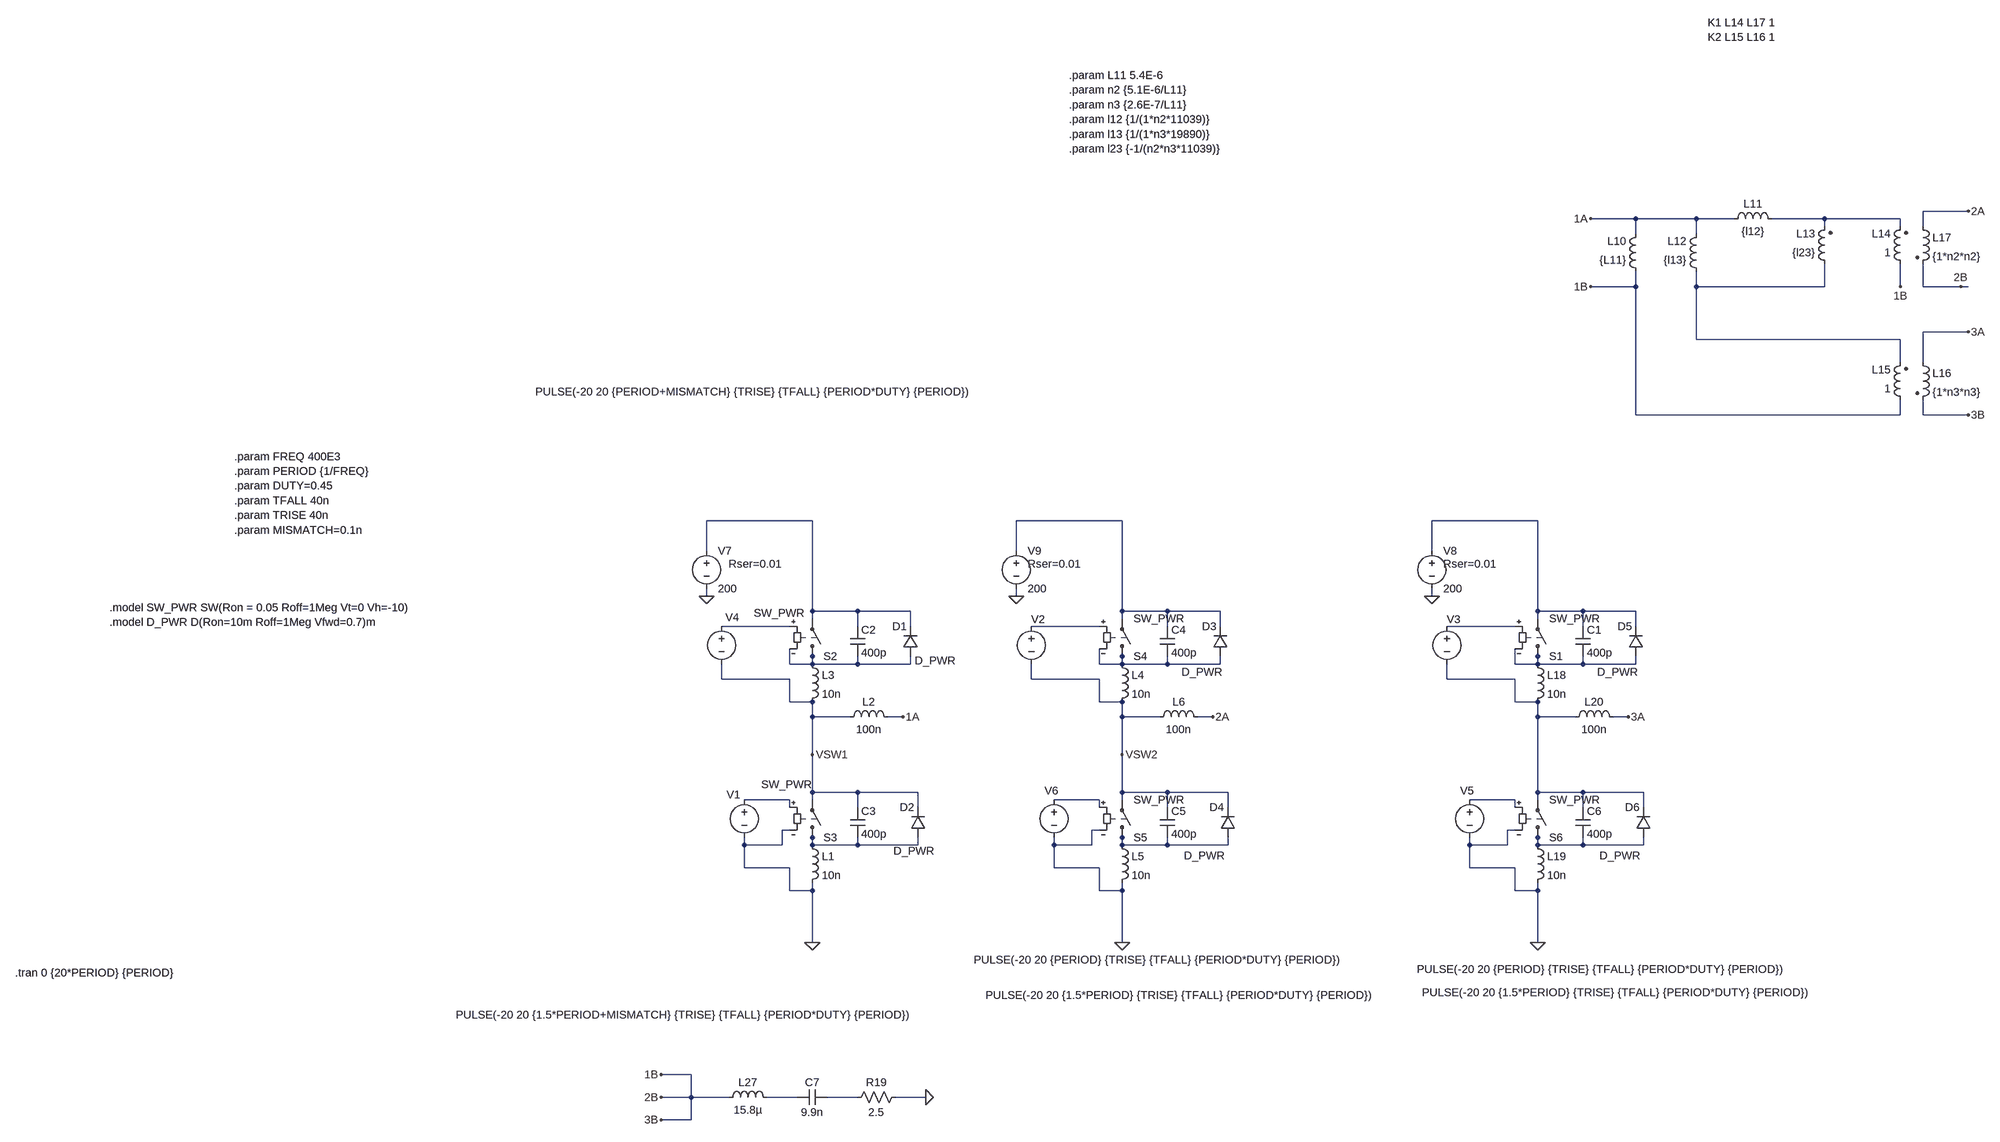
[diagram p0: schematic inverter_mismatch.asc]
inverter_mismatch.asc, the LTspice schematic file:
Version 4
SHEET 1 3140 2060
WIRE 2576 -784 2480 -784
WIRE 1872 -768 1776 -768
WIRE 2000 -768 1872 -768
WIRE 2080 -768 2000 -768
WIRE 2272 -768 2160 -768
WIRE 2432 -768 2272 -768
WIRE 2272 -752 2272 -768
WIRE 2432 -752 2432 -768
WIRE 2480 -752 2480 -784
WIRE 1872 -736 1872 -768
WIRE 2000 -736 2000 -768
WIRE 1872 -624 1872 -656
WIRE 1872 -624 1776 -624
WIRE 2000 -624 2000 -656
WIRE 2272 -624 2272 -672
WIRE 2272 -624 2000 -624
WIRE 2432 -624 2432 -672
WIRE 2480 -624 2480 -672
WIRE 2560 -624 2480 -624
WIRE 2576 -624 2560 -624
WIRE 2576 -528 2480 -528
WIRE 2000 -512 2000 -624
WIRE 2432 -512 2000 -512
WIRE 2432 -464 2432 -512
WIRE 2480 -464 2480 -528
WIRE 1872 -352 1872 -624
WIRE 2432 -352 2432 -384
WIRE 2432 -352 1872 -352
WIRE 2480 -352 2480 -384
WIRE 2576 -352 2480 -352
WIRE 128 -128 -96 -128
WIRE 784 -128 560 -128
WIRE 1664 -128 1440 -128
WIRE -96 -64 -96 -128
WIRE 560 -64 560 -128
WIRE 1440 -64 1440 -128
WIRE -96 32 -96 16
WIRE 560 32 560 16
WIRE 1440 32 1440 16
WIRE 128 64 128 -128
WIRE 224 64 128 64
WIRE 336 64 224 64
WIRE 784 64 784 -128
WIRE 880 64 784 64
WIRE 992 64 880 64
WIRE 1664 64 1664 -128
WIRE 1760 64 1664 64
WIRE 1872 64 1760 64
WIRE 128 80 128 64
WIRE 784 80 784 64
WIRE 1664 80 1664 64
WIRE 80 96 -64 96
WIRE 224 96 224 64
WIRE 336 96 336 64
WIRE 736 96 592 96
WIRE 880 96 880 64
WIRE 992 96 992 64
WIRE 1616 96 1472 96
WIRE 1760 96 1760 64
WIRE 1872 96 1872 64
WIRE 128 160 128 144
WIRE 784 160 784 144
WIRE 1664 160 1664 144
WIRE 80 176 80 144
WIRE 128 176 128 160
WIRE 128 176 80 176
WIRE 224 176 224 160
WIRE 224 176 128 176
WIRE 336 176 336 160
WIRE 336 176 224 176
WIRE 736 176 736 144
WIRE 784 176 784 160
WIRE 784 176 736 176
WIRE 880 176 880 160
WIRE 880 176 784 176
WIRE 992 176 992 160
WIRE 992 176 880 176
WIRE 1616 176 1616 144
WIRE 1664 176 1664 160
WIRE 1664 176 1616 176
WIRE 1760 176 1760 160
WIRE 1760 176 1664 176
WIRE 1872 176 1872 160
WIRE 1872 176 1760 176
WIRE -64 208 -64 176
WIRE 80 208 -64 208
WIRE 592 208 592 176
WIRE 736 208 592 208
WIRE 1472 208 1472 176
WIRE 1616 208 1472 208
WIRE 80 256 80 208
WIRE 128 256 80 256
WIRE 736 256 736 208
WIRE 784 256 736 256
WIRE 1616 256 1616 208
WIRE 1664 256 1616 256
WIRE 128 288 128 256
WIRE 208 288 128 288
WIRE 320 288 288 288
WIRE 784 288 784 256
WIRE 864 288 784 288
WIRE 976 288 944 288
WIRE 1664 288 1664 256
WIRE 1744 288 1664 288
WIRE 1856 288 1824 288
WIRE 128 368 128 288
WIRE 784 368 784 288
WIRE 128 448 128 368
WIRE 224 448 128 448
WIRE 352 448 224 448
WIRE 784 448 784 368
WIRE 880 448 784 448
WIRE 1008 448 880 448
WIRE 1664 448 1664 288
WIRE 1760 448 1664 448
WIRE 1888 448 1760 448
WIRE 80 464 -16 464
WIRE 128 464 128 448
WIRE 736 464 640 464
WIRE 784 464 784 448
WIRE 1616 464 1520 464
WIRE 1664 464 1664 448
WIRE 80 480 80 464
WIRE 224 480 224 448
WIRE 352 480 352 448
WIRE 736 480 736 464
WIRE 880 480 880 448
WIRE 1008 480 1008 448
WIRE 1616 480 1616 464
WIRE 1760 480 1760 448
WIRE 1888 480 1888 448
WIRE 80 528 64 528
WIRE 736 528 720 528
WIRE 1616 528 1600 528
WIRE 128 544 128 528
WIRE 784 544 784 528
WIRE 1664 544 1664 528
WIRE -16 560 -16 544
WIRE 64 560 64 528
WIRE 64 560 -16 560
WIRE 128 560 128 544
WIRE 224 560 224 544
WIRE 224 560 128 560
WIRE 352 560 352 544
WIRE 352 560 224 560
WIRE 640 560 640 544
WIRE 720 560 720 528
WIRE 720 560 640 560
WIRE 784 560 784 544
WIRE 880 560 880 544
WIRE 880 560 784 560
WIRE 1008 560 1008 544
WIRE 1008 560 880 560
WIRE 1520 560 1520 544
WIRE 1600 560 1600 528
WIRE 1600 560 1520 560
WIRE 1664 560 1664 544
WIRE 1760 560 1760 544
WIRE 1760 560 1664 560
WIRE 1888 560 1888 544
WIRE 1888 560 1760 560
WIRE -16 608 -16 560
WIRE 80 608 -16 608
WIRE 640 608 640 560
WIRE 736 608 640 608
WIRE 1520 608 1520 560
WIRE 1616 608 1520 608
WIRE 80 656 80 608
WIRE 128 656 128 640
WIRE 128 656 80 656
WIRE 736 656 736 608
WIRE 784 656 784 640
WIRE 784 656 736 656
WIRE 1616 656 1616 608
WIRE 1664 656 1664 640
WIRE 1664 656 1616 656
WIRE 128 768 128 656
WIRE 784 768 784 656
WIRE 1664 768 1664 656
WIRE -128 1408 -192 1408
WIRE -128 1456 -128 1408
WIRE -128 1456 -192 1456
WIRE -48 1456 -128 1456
WIRE 96 1456 32 1456
WIRE 224 1456 160 1456
WIRE 368 1456 304 1456
WIRE -128 1504 -128 1456
WIRE -128 1504 -192 1504
FLAG 368 1456 0
FLAG 128 768 0
FLAG -96 32 0
FLAG 784 768 0
FLAG 560 32 0
FLAG 128 368 VSW1
FLAG 784 368 VSW2
FLAG 1776 -768 1A
FLAG 1776 -624 1B
FLAG 2432 -624 1B
FLAG 2576 -784 2A
FLAG 2560 -624 2B
FLAG 2576 -528 3A
FLAG 2576 -352 3B
FLAG 1664 768 0
FLAG 1440 32 0
FLAG 320 288 1A
FLAG 976 288 2A
FLAG 1856 288 3A
FLAG -192 1408 1B
FLAG -192 1456 2B
FLAG -192 1504 3B
SYMBOL ind -64 1472 R270
WINDOW 0 32 56 VTop 2
WINDOW 3 5 56 VBottom 2
SYMATTR InstName L27
SYMATTR Value 15.8µ
SYMBOL cap 160 1440 R90
WINDOW 0 0 32 VBottom 2
WINDOW 3 32 32 VTop 2
SYMATTR InstName C7
SYMATTR Value 9.9n
SYMBOL res 320 1440 R90
WINDOW 0 0 56 VBottom 2
WINDOW 3 32 56 VTop 2
SYMATTR InstName R19
SYMATTR Value 2.5
SYMBOL voltage -64 80 R0
WINDOW 3 -394 -481 Left 2
WINDOW 123 0 0 Left 0
WINDOW 39 0 0 Left 0
WINDOW 0 8 -3 Left 2
SYMATTR Value PULSE(-20 20 {PERIOD+MISMATCH} {TRISE} {TFALL} {PERIOD*DUTY} {PERIOD})
SYMATTR InstName V4
SYMBOL voltage -16 448 R0
WINDOW 3 -611 473 Left 2
WINDOW 123 0 0 Left 0
WINDOW 39 0 0 Left 0
WINDOW 0 -37 5 Left 2
SYMATTR Value PULSE(-20 20 {1.5*PERIOD+MISMATCH} {TRISE} {TFALL} {PERIOD*DUTY} {PERIOD})
SYMATTR InstName V1
SYMBOL voltage 592 80 R0
WINDOW 3 -122 725 Left 2
WINDOW 123 0 0 Left 0
WINDOW 39 0 0 Left 0
WINDOW 0 0 1 Left 2
SYMATTR Value PULSE(-20 20 {PERIOD} {TRISE} {TFALL} {PERIOD*DUTY} {PERIOD})
SYMATTR InstName V2
SYMBOL voltage 640 448 R0
WINDOW 3 -145 432 Left 2
WINDOW 123 0 0 Left 0
WINDOW 39 0 0 Left 0
WINDOW 0 -20 -3 Left 2
SYMATTR Value PULSE(-20 20 {1.5*PERIOD} {TRISE} {TFALL} {PERIOD*DUTY} {PERIOD})
SYMATTR InstName V6
SYMBOL voltage -96 -80 R0
WINDOW 123 0 0 Left 0
WINDOW 39 47 44 Left 2
SYMATTR SpiceLine Rser=0.01
SYMATTR InstName V7
SYMATTR Value 200
SYMBOL sw 128 176 M180
WINDOW 3 -124 108 Left 2
SYMATTR InstName S2
SYMATTR Value SW_PWR
SYMBOL cap 208 96 R0
SYMATTR InstName C2
SYMATTR Value 400p
SYMATTR SpiceLine Rser=500m
SYMBOL ind 112 160 R0
SYMATTR InstName L3
SYMATTR Value 10n
SYMATTR SpiceLine Rser=10m
SYMBOL sw 128 560 M180
WINDOW 3 -108 129 Left 2
SYMATTR InstName S3
SYMATTR Value SW_PWR
SYMBOL cap 208 480 R0
SYMATTR InstName C3
SYMATTR Value 400p
SYMATTR SpiceLine Rser=500m
SYMBOL ind 112 544 R0
SYMATTR InstName L1
SYMATTR Value 10n
SYMATTR SpiceLine Rser=10m
SYMBOL diode 352 160 R180
WINDOW 0 24 64 Left 2
WINDOW 3 -79 -9 Left 2
SYMATTR InstName D1
SYMATTR Value D_PWR
SYMBOL diode 368 544 R180
WINDOW 0 24 64 Left 2
WINDOW 3 -18 -28 Left 2
SYMATTR InstName D2
SYMATTR Value D_PWR
SYMBOL voltage 560 -80 R0
WINDOW 123 0 0 Left 0
WINDOW 39 24 44 Left 2
SYMATTR SpiceLine Rser=0.01
SYMATTR InstName V9
SYMATTR Value 200
SYMBOL sw 784 176 M180
SYMATTR InstName S4
SYMATTR Value SW_PWR
SYMBOL cap 864 96 R0
SYMATTR InstName C4
SYMATTR Value 400p
SYMATTR SpiceLine Rser=500m
SYMBOL ind 768 160 R0
SYMATTR InstName L4
SYMATTR Value 10n
SYMATTR SpiceLine Rser=10m
SYMBOL sw 784 560 M180
SYMATTR InstName S5
SYMATTR Value SW_PWR
SYMBOL cap 864 480 R0
SYMATTR InstName C5
SYMATTR Value 400p
SYMATTR SpiceLine Rser=500m
SYMBOL ind 768 544 R0
SYMATTR InstName L5
SYMATTR Value 10n
SYMATTR SpiceLine Rser=10m
SYMBOL diode 1008 160 R180
WINDOW 0 24 64 Left 2
WINDOW 3 12 -33 Left 2
SYMATTR InstName D3
SYMATTR Value D_PWR
SYMBOL diode 1024 544 R180
WINDOW 0 24 64 Left 2
WINDOW 3 23 -38 Left 2
SYMATTR InstName D4
SYMATTR Value D_PWR
SYMBOL ind 192 304 R270
WINDOW 0 32 56 VTop 2
WINDOW 3 5 56 VBottom 2
SYMATTR InstName L2
SYMATTR Value 100n
SYMBOL ind 848 304 R270
WINDOW 0 32 56 VTop 2
WINDOW 3 5 56 VBottom 2
SYMATTR InstName L6
SYMATTR Value 100n
SYMBOL ind 1888 -640 R180
WINDOW 0 36 80 Left 2
WINDOW 3 36 40 Left 2
SYMATTR InstName L10
SYMATTR Value {L11}
SYMBOL ind 2064 -752 R270
WINDOW 0 32 56 VTop 2
WINDOW 3 5 56 VBottom 2
SYMATTR InstName L11
SYMATTR Value {l12}
SYMBOL ind 2016 -640 R180
WINDOW 0 36 80 Left 2
WINDOW 3 36 40 Left 2
SYMATTR InstName L12
SYMATTR Value {l13}
SYMBOL ind2 2288 -656 R180
WINDOW 0 36 80 Left 2
WINDOW 3 36 40 Left 2
SYMATTR InstName L13
SYMATTR Value {l23}
SYMATTR Type ind
SYMBOL ind2 2448 -656 R180
WINDOW 0 36 80 Left 2
WINDOW 3 36 40 Left 2
SYMATTR InstName L14
SYMATTR Value 1
SYMATTR Type ind
SYMBOL ind2 2448 -368 R180
WINDOW 0 36 80 Left 2
WINDOW 3 36 40 Left 2
SYMATTR InstName L15
SYMATTR Value 1
SYMATTR Type ind
SYMBOL ind2 2464 -480 R0
SYMATTR InstName L16
SYMATTR Value {1*n3*n3}
SYMATTR Type ind
SYMBOL ind2 2464 -768 R0
SYMATTR InstName L17
SYMATTR Value {1*n2*n2}
SYMATTR Type ind
SYMBOL voltage 1472 80 R0
WINDOW 3 -64 745 Left 2
WINDOW 123 0 0 Left 0
WINDOW 39 0 0 Left 0
WINDOW 0 0 1 Left 2
SYMATTR Value PULSE(-20 20 {PERIOD} {TRISE} {TFALL} {PERIOD*DUTY} {PERIOD})
SYMATTR InstName V3
SYMBOL voltage 1520 448 R0
WINDOW 3 -101 426 Left 2
WINDOW 123 0 0 Left 0
WINDOW 39 0 0 Left 0
WINDOW 0 -20 -3 Left 2
SYMATTR Value PULSE(-20 20 {1.5*PERIOD} {TRISE} {TFALL} {PERIOD*DUTY} {PERIOD})
SYMATTR InstName V5
SYMBOL voltage 1440 -80 R0
WINDOW 123 0 0 Left 0
WINDOW 39 24 44 Left 2
SYMATTR SpiceLine Rser=0.01
SYMATTR InstName V8
SYMATTR Value 200
SYMBOL sw 1664 176 M180
SYMATTR InstName S1
SYMATTR Value SW_PWR
SYMBOL cap 1744 96 R0
SYMATTR InstName C1
SYMATTR Value 400p
SYMATTR SpiceLine Rser=500m
SYMBOL ind 1648 160 R0
SYMATTR InstName L18
SYMATTR Value 10n
SYMATTR SpiceLine Rser=10m
SYMBOL sw 1664 560 M180
SYMATTR InstName S6
SYMATTR Value SW_PWR
SYMBOL cap 1744 480 R0
SYMATTR InstName C6
SYMATTR Value 400p
SYMATTR SpiceLine Rser=500m
SYMBOL ind 1648 544 R0
SYMATTR InstName L19
SYMATTR Value 10n
SYMATTR SpiceLine Rser=10m
SYMBOL diode 1888 160 R180
WINDOW 0 24 64 Left 2
WINDOW 3 12 -33 Left 2
SYMATTR InstName D5
SYMATTR Value D_PWR
SYMBOL diode 1904 544 R180
WINDOW 0 24 64 Left 2
WINDOW 3 23 -38 Left 2
SYMATTR InstName D6
SYMATTR Value D_PWR
SYMBOL ind 1728 304 R270
WINDOW 0 32 56 VTop 2
WINDOW 3 5 56 VBottom 2
SYMATTR InstName L20
SYMATTR Value 100n
TEXT -1096 -264 Left 2 !.param FREQ 400E3\n.param PERIOD {1/FREQ}\n.param DUTY=0.45\n.param TFALL 40n\n.param TRISE 40n\n.param MISMATCH=0.1n
TEXT -1560 832 Left 2 !.tran 0 {20*PERIOD} {PERIOD}
TEXT -1360 56 Left 2 !.model SW_PWR SW(Ron = 0.05 Roff=1Meg Vt=0 Vh=-10)\n.model D_PWR D(Ron=10m Roff=1Meg Vfwd=0.7)m
TEXT 672 -1072 Left 2 !.param L11 5.4E-6\n.param n2 {5.1E-6/L11}\n.param n3 {2.6E-7/L11}\n.param l12 {1/(1*n2*11039)}\n.param l13 {1/(1*n3*19890)}\n.param l23 {-1/(n2*n3*11039)}
TEXT 2024 -1184 Left 2 !K1 L14 L17 1\nK2 L15 L16 1

The netlist it stands for:
* inverter_mismatch.asc
L27 3B N019 15.8µ
C7 N020 N019 9.9n
R19 0 N020 2.5
V4 N006 VSW1 PULSE(-20 20 {PERIOD+MISMATCH} {TRISE} {TFALL} {PERIOD*DUTY} {PERIOD})
V1 N013 0 PULSE(-20 20 {1.5*PERIOD+MISMATCH} {TRISE} {TFALL} {PERIOD*DUTY} {PERIOD})
V2 N007 VSW2 PULSE(-20 20 {PERIOD} {TRISE} {TFALL} {PERIOD*DUTY} {PERIOD})
V6 N014 0 PULSE(-20 20 {1.5*PERIOD} {TRISE} {TFALL} {PERIOD*DUTY} {PERIOD})
V7 N003 0 200 Rser=0.01
S2 N009 N003 N006 N009 SW_PWR
C2 N003 N009 400p Rser=500m
L3 N009 VSW1 10n Rser=10m
S3 N016 VSW1 N013 0 SW_PWR
C3 VSW1 N016 400p Rser=500m
L1 N016 0 10n Rser=10m
D1 N009 N003 D_PWR
D2 N016 VSW1 D_PWR
V9 N004 0 200 Rser=0.01
S4 N010 N004 N007 N010 SW_PWR
C4 N004 N010 400p Rser=500m
L4 N010 VSW2 10n Rser=10m
S5 N017 VSW2 N014 0 SW_PWR
C5 VSW2 N017 400p Rser=500m
L5 N017 0 10n Rser=10m
D3 N010 N004 D_PWR
D4 N017 VSW2 D_PWR
L2 VSW1 1A 100n
L6 VSW2 2A 100n
L10 3B 1A {L11}
L11 1A N001 {l12}
L12 N002 1A {l13}
L13 N002 N001 {l23}
L14 3B N001 1
L15 3B N002 1
L16 3A 3B {1*n3*n3}
L17 2A 3B {1*n2*n2}
V3 N008 N012 PULSE(-20 20 {PERIOD} {TRISE} {TFALL} {PERIOD*DUTY} {PERIOD})
V5 N015 0 PULSE(-20 20 {1.5*PERIOD} {TRISE} {TFALL} {PERIOD*DUTY} {PERIOD})
V8 N005 0 200 Rser=0.01
S1 N011 N005 N008 N011 SW_PWR
C1 N005 N011 400p Rser=500m
L18 N011 N012 10n Rser=10m
S6 N018 N012 N015 0 SW_PWR
C6 N012 N018 400p Rser=500m
L19 N018 0 10n Rser=10m
D5 N011 N005 D_PWR
D6 N018 N012 D_PWR
L20 N012 3A 100n
.model D D
.lib standard.dio
.param FREQ 400E3
.param PERIOD {1/FREQ}
.param DUTY=0.45
.param TFALL 40n
.param TRISE 40n
.param MISMATCH=0.1n
.tran 0 {20*PERIOD} {PERIOD}
.model SW_PWR SW(Ron = 0.05 Roff=1Meg Vt=0 Vh=-10)
.model D_PWR D(Ron=10m Roff=1Meg Vfwd=0.7)m
.param L11 5.4E-6
.param n2 {5.1E-6/L11}
.param n3 {2.6E-7/L11}
.param l12 {1/(1*n2*11039)}
.param l13 {1/(1*n3*19890)}
.param l23 {-1/(n2*n3*11039)}
K1 L14 L17 1
K2 L15 L16 1
.backanno
.end